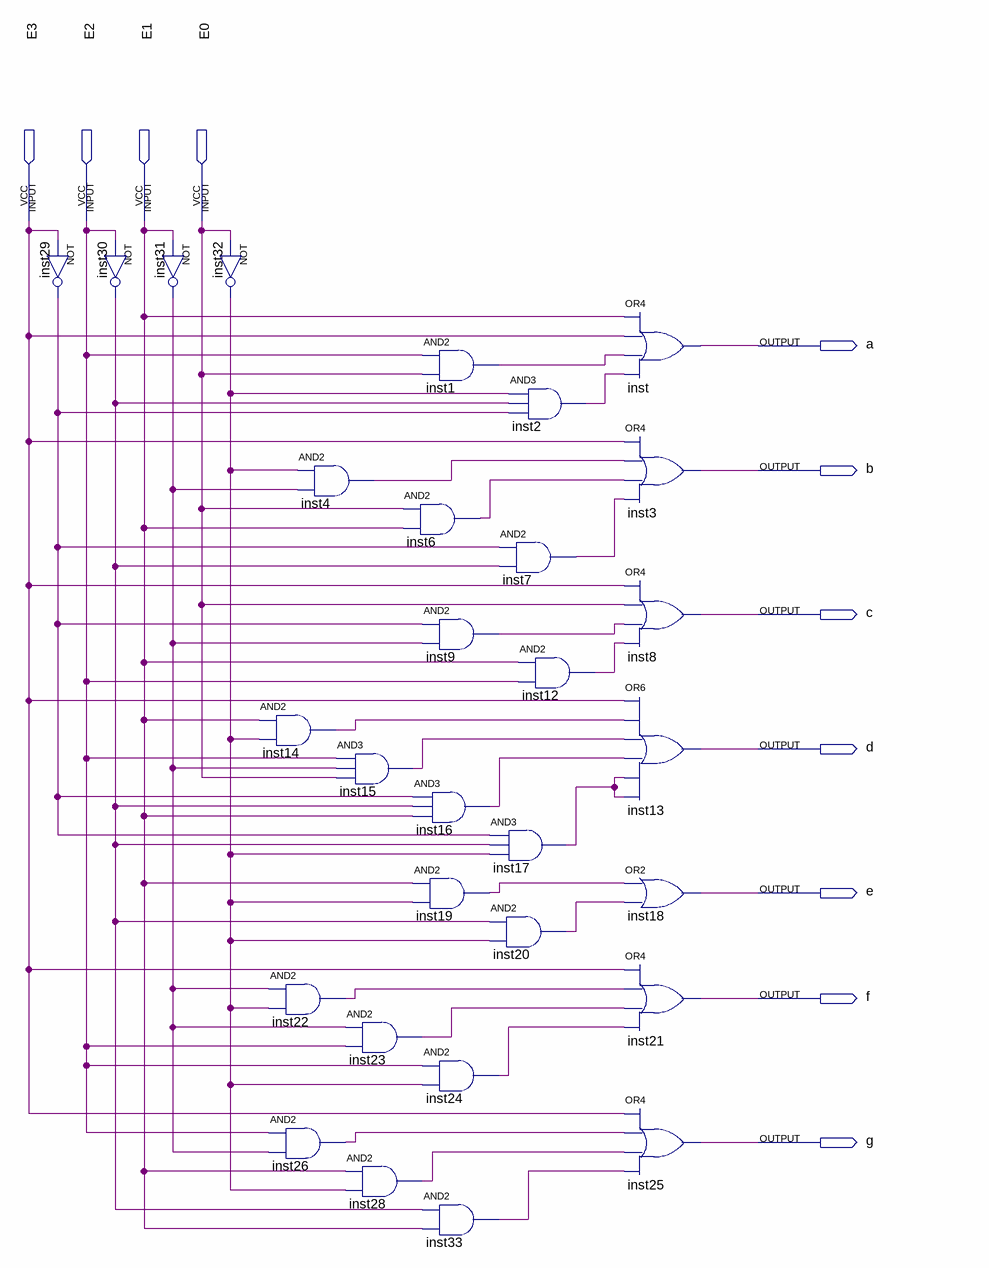
[diagram p0: schematic sheet]
// Quartus schematic BCD4.bdf as structural Verilog: 30 symbols, 11 pins
module BCD4 (
  input  E3,
  input  E2,
  input  E1,
  input  E0,
  output a,
  output b,
  output c,
  output d,
  output e,
  output f,
  output g
);

  wire inst1_out, inst2_out, inst4_out, inst6_out, inst7_out, inst9_out, inst12_out, inst14_out, inst15_out,
       inst16_out, inst17_out, inst19_out, inst20_out, inst22_out, inst23_out, inst24_out, inst26_out,
       inst28_out, inst29_out, inst30_out, inst31_out, inst32_out, inst33_out;

  not inst29 (inst29_out, E3);
  not inst30 (inst30_out, E2);
  not inst31 (inst31_out, E1);
  not inst32 (inst32_out, E0);
  and inst4 (inst4_out, inst32_out, inst31_out);
  and inst14 (inst14_out, E1, inst32_out);
  and inst22 (inst22_out, inst31_out, inst32_out);
  and inst26 (inst26_out, E2, inst31_out);
  and inst6 (inst6_out, E0, E1);
  and inst15 (inst15_out, E2, inst31_out, E0);
  and inst23 (inst23_out, inst31_out, E2);
  and inst28 (inst28_out, E1, inst32_out);
  and inst1 (inst1_out, E2, E0);
  and inst9 (inst9_out, inst29_out, inst31_out);
  and inst16 (inst16_out, inst29_out, inst30_out, E1);
  and inst19 (inst19_out, E1, inst32_out);
  and inst24 (inst24_out, E2, inst32_out);
  and inst33 (inst33_out, inst30_out, E1);
  and inst2 (inst2_out, inst32_out, inst30_out, inst29_out);
  and inst7 (inst7_out, inst29_out, inst30_out);
  and inst12 (inst12_out, E1, E2);
  and inst17 (inst17_out, inst29_out, inst30_out, inst32_out);
  and inst20 (inst20_out, inst30_out, inst32_out);
  or inst (a, E1, E3, inst1_out, inst2_out);
  or inst3 (b, E3, inst4_out, inst6_out, inst7_out);
  or inst8 (c, E3, E0, inst9_out, inst12_out);
  or inst13 (d, E3, inst14_out, inst15_out, inst16_out, inst17_out, inst17_out);
  or inst18 (e, inst19_out, inst20_out);
  or inst21 (f, E3, inst22_out, inst23_out, inst24_out);
  or inst25 (g, E3, inst26_out, inst28_out, inst33_out);
endmodule
